# EAGLE design stm32-shield (EAGLE 9.6.2)
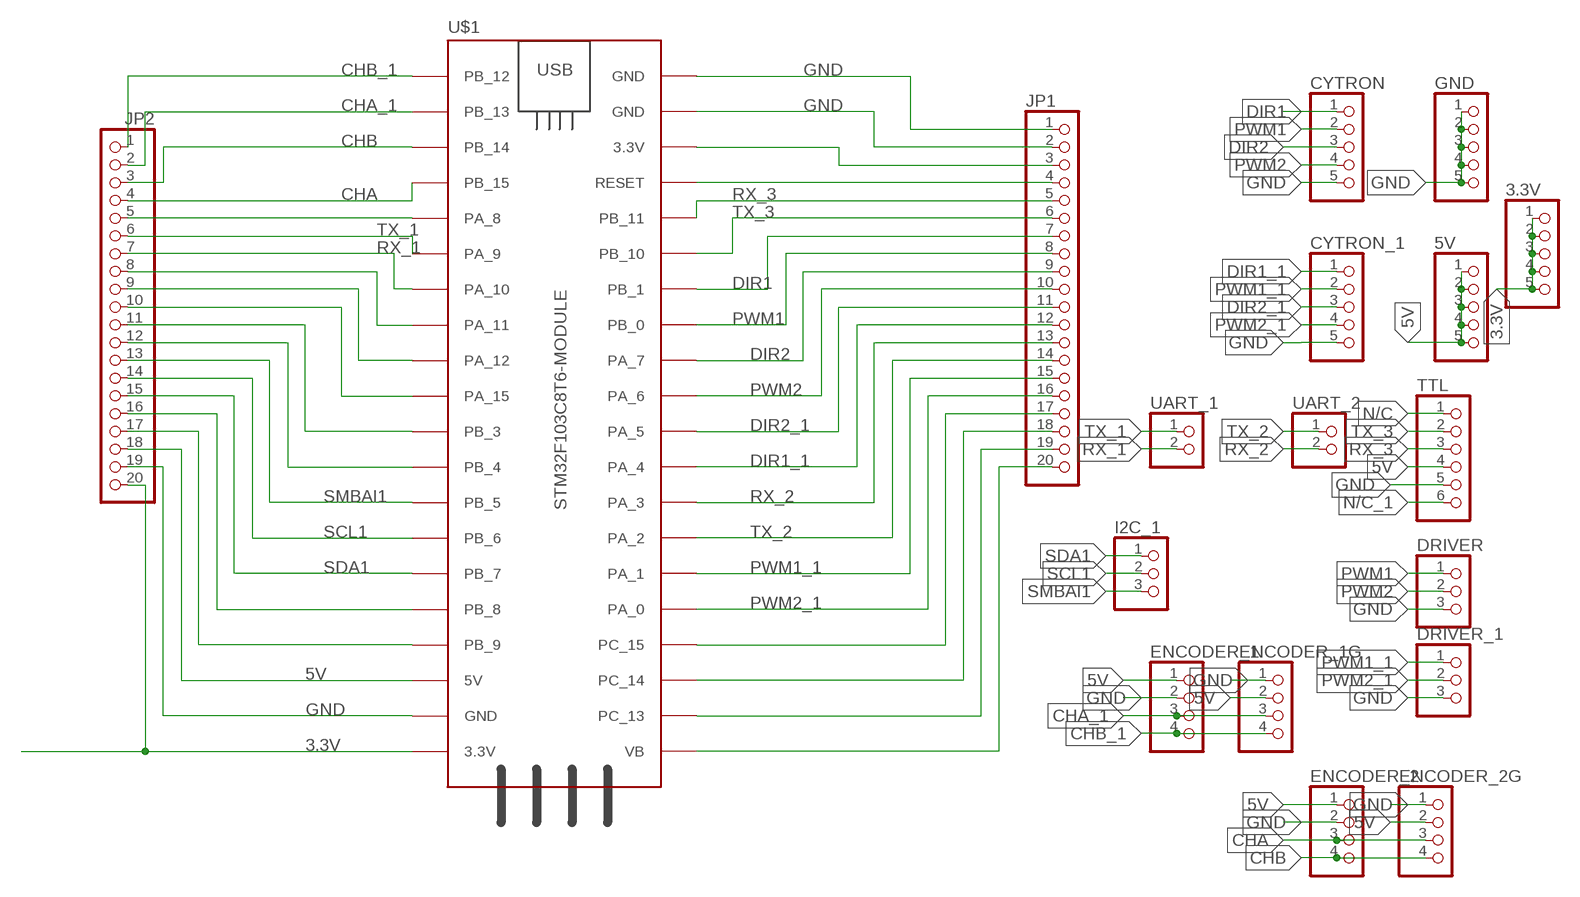
[diagram p0: schematic, sheet 1]

## Parts
3.3V  PINHD-1X5  [1X05]
5V  PINHD-1X5  [1X05]
CYTRON  PINHD-1X5  [1X05]
CYTRON_1  PINHD-1X5  [1X05]
DRIVER  PINHD-1X3  [1X03]
DRIVER_1  PINHD-1X3  [1X03]
ENCODER_1  PINHD-1X4  [1X04]
ENCODER_1G  PINHD-1X4  [1X04]
ENCODER_2  PINHD-1X4  [1X04]
ENCODER_2G  PINHD-1X4  [1X04]
GND  PINHD-1X5  [1X05]
I2C_1  PINHD-1X3  [1X03]
JP1  PINHD-1X20  [1X20]
JP2  PINHD-1X20  [1X20]
TTL  PINHD-1X6  [1X06]
U$1  STM32F103C8T6-MODULE  [STM32F103C8T6-MODULE]
UART_1  PINHD-1X2  [1X02]
UART_2  PINHD-1X2  [1X02]

## Nets
3.3V: 3.3V.1 3.3V.2 3.3V.3 3.3V.4 3.3V.5 JP2.20 U$1.3.3V_1(3.3V)
5V: 5V.1 5V.2 5V.3 5V.4 5V.5 ENCODER_1.1 ENCODER_1G.2 ENCODER_2.1 ENCODER_2G.2 JP2.18 TTL.4 U$1.5V
8183: JP2.17 U$1.PB_9
823828: JP2.16 U$1.PB_8
CHA: ENCODER_2.3 ENCODER_2G.3 JP2.4 U$1.PB_15
CHA_1: ENCODER_1.3 ENCODER_1G.3 JP2.2 U$1.PB_13
CHB: ENCODER_2.4 ENCODER_2G.4 JP2.3 U$1.PB_14
CHB_1: ENCODER_1.4 ENCODER_1G.4 JP2.1 U$1.PB_12
DIR1: CYTRON.1 JP1.7 U$1.PB_1
DIR1_1: CYTRON_1.1 JP1.12 U$1.PA_4
DIR2: CYTRON.3 JP1.9 U$1.PA_7
DIR2_1: CYTRON_1.3 JP1.11 U$1.PA_5
GND: CYTRON.5 CYTRON_1.5 DRIVER.3 DRIVER_1.3 ENCODER_1.2 ENCODER_1G.1 ENCODER_2.2 ENCODER_2G.1 GND.1 GND.2 GND.3 GND.4 GND.5 JP1.1 JP1.2 JP2.19 TTL.5 U$1.GND_1(GND) U$1.GND_2(GND) U$1.GND_3(GND)
N$3: JP1.3 U$1.3.3V_2(3.3V)
N$4: JP1.4 U$1.RESET
N$17: JP1.17 U$1.PC_15
N$18: JP1.18 U$1.PC_14
N$19: JP1.19 U$1.PC_13
N$20: JP1.20 U$1.VB
N$25: JP2.5 U$1.PA_8
N$28: JP2.8 U$1.PA_11
N$29: JP2.9 U$1.PA_12
N$30: JP2.10 U$1.PA_15
N$31: JP2.11 U$1.PB_3
N$32: JP2.12 U$1.PB_4
N/C: TTL.1
N/C_1: TTL.6
PWM1: CYTRON.2 DRIVER.1 JP1.8 U$1.PB_0
PWM1_1: CYTRON_1.2 DRIVER_1.1 JP1.15 U$1.PA_1
PWM2: CYTRON.4 DRIVER.2 JP1.10 U$1.PA_6
PWM2_1: CYTRON_1.4 DRIVER_1.2 JP1.16 U$1.PA_0
RX_1: JP2.7 U$1.PA_10 UART_1.2
RX_2: JP1.13 U$1.PA_3 UART_2.2
RX_3: JP1.5 TTL.3 U$1.PB_11
SCL1: I2C_1.2 JP2.14 U$1.PB_6
SDA1: I2C_1.1 JP2.15 U$1.PB_7
SMBAI1: I2C_1.3 JP2.13 U$1.PB_5
TX_1: JP2.6 U$1.PA_9 UART_1.1
TX_2: JP1.14 U$1.PA_2 UART_2.1
TX_3: JP1.6 TTL.2 U$1.PB_10

## Library data of the parts
3.3V 5V CYTRON CYTRON_1 GND = pinhead:PINHD-1X5: PIN HEADER
DRIVER DRIVER_1 I2C_1 = pinhead:PINHD-1X3: PIN HEADER
ENCODER_1 ENCODER_1G ENCODER_2 ENCODER_2G = pinhead:PINHD-1X4: PIN HEADER
JP1 JP2 = pinhead:PINHD-1X20: PIN HEADER
TTL = pinhead:PINHD-1X6: PIN HEADER
U$1 = stm32f103c8t6_module:STM32F103C8T6-MODULE: STM32F103C8T6 module with ARM Cortex-3, 20kB SRAM, 64kB Flash, 72MHz
UART_1 UART_2 = pinhead:PINHD-1X2: PIN HEADER

## Board
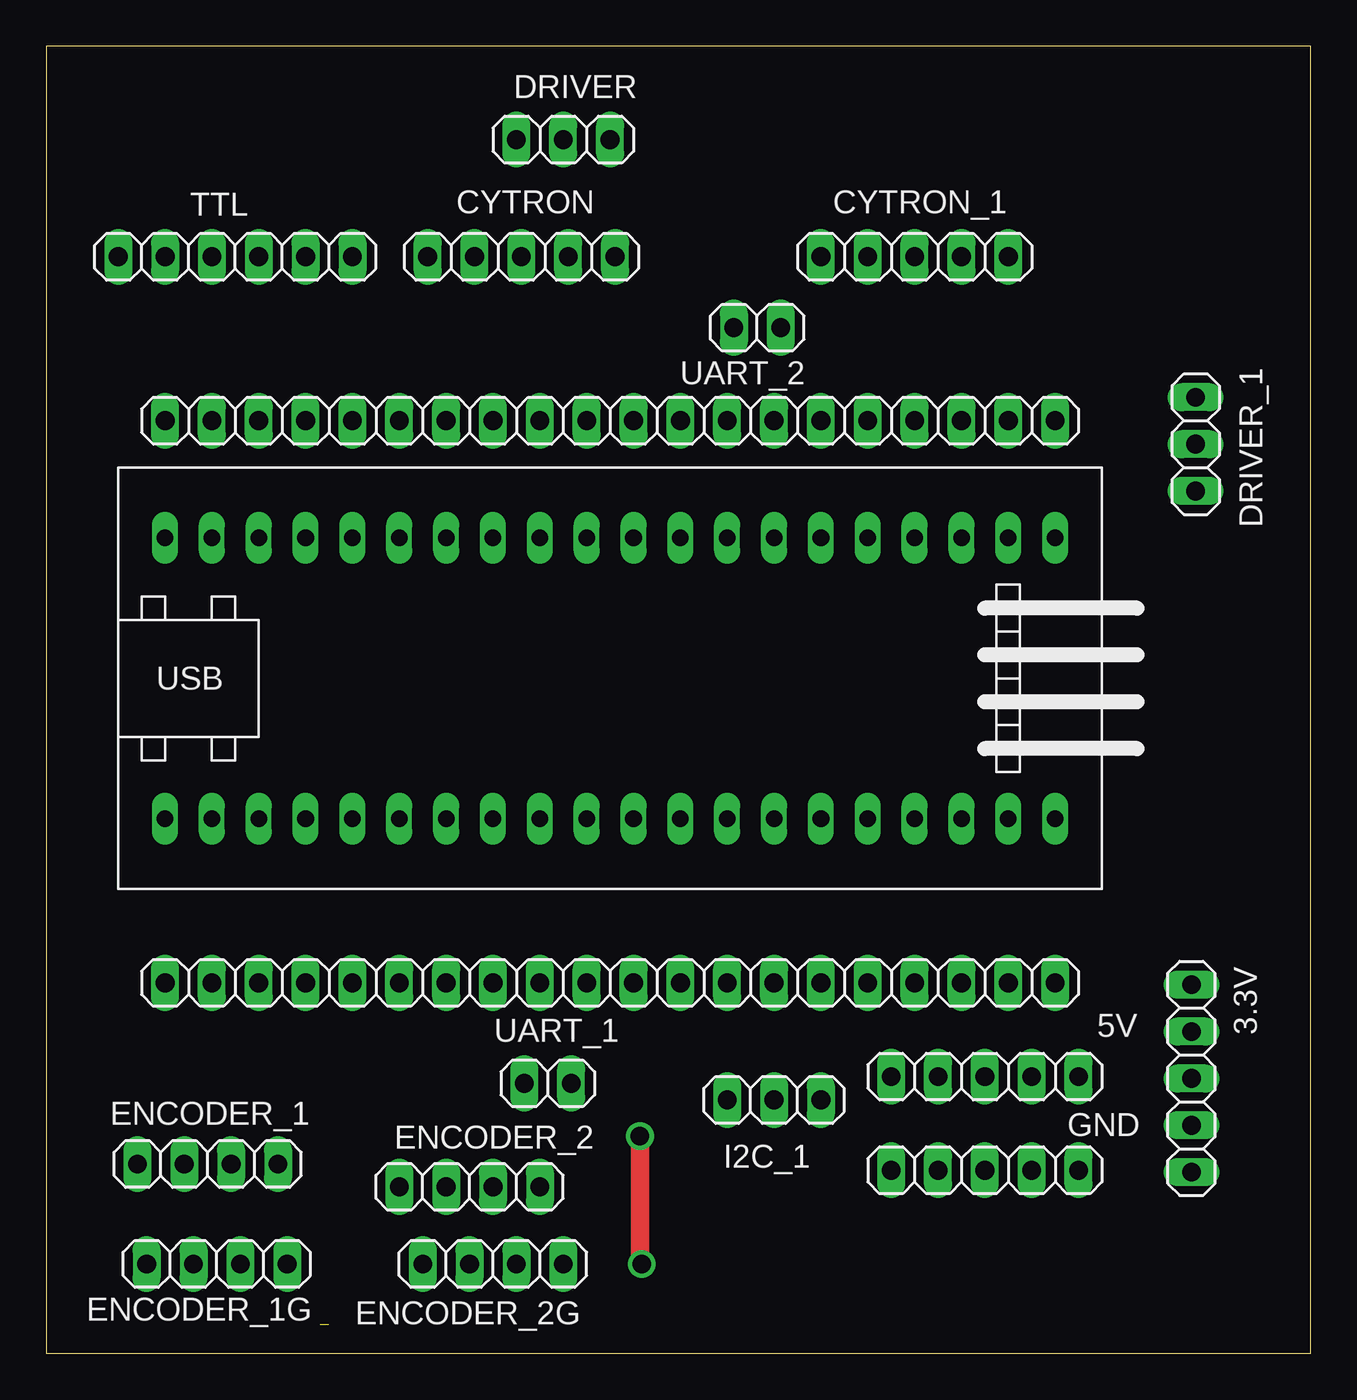
[diagram p1: board, top side]
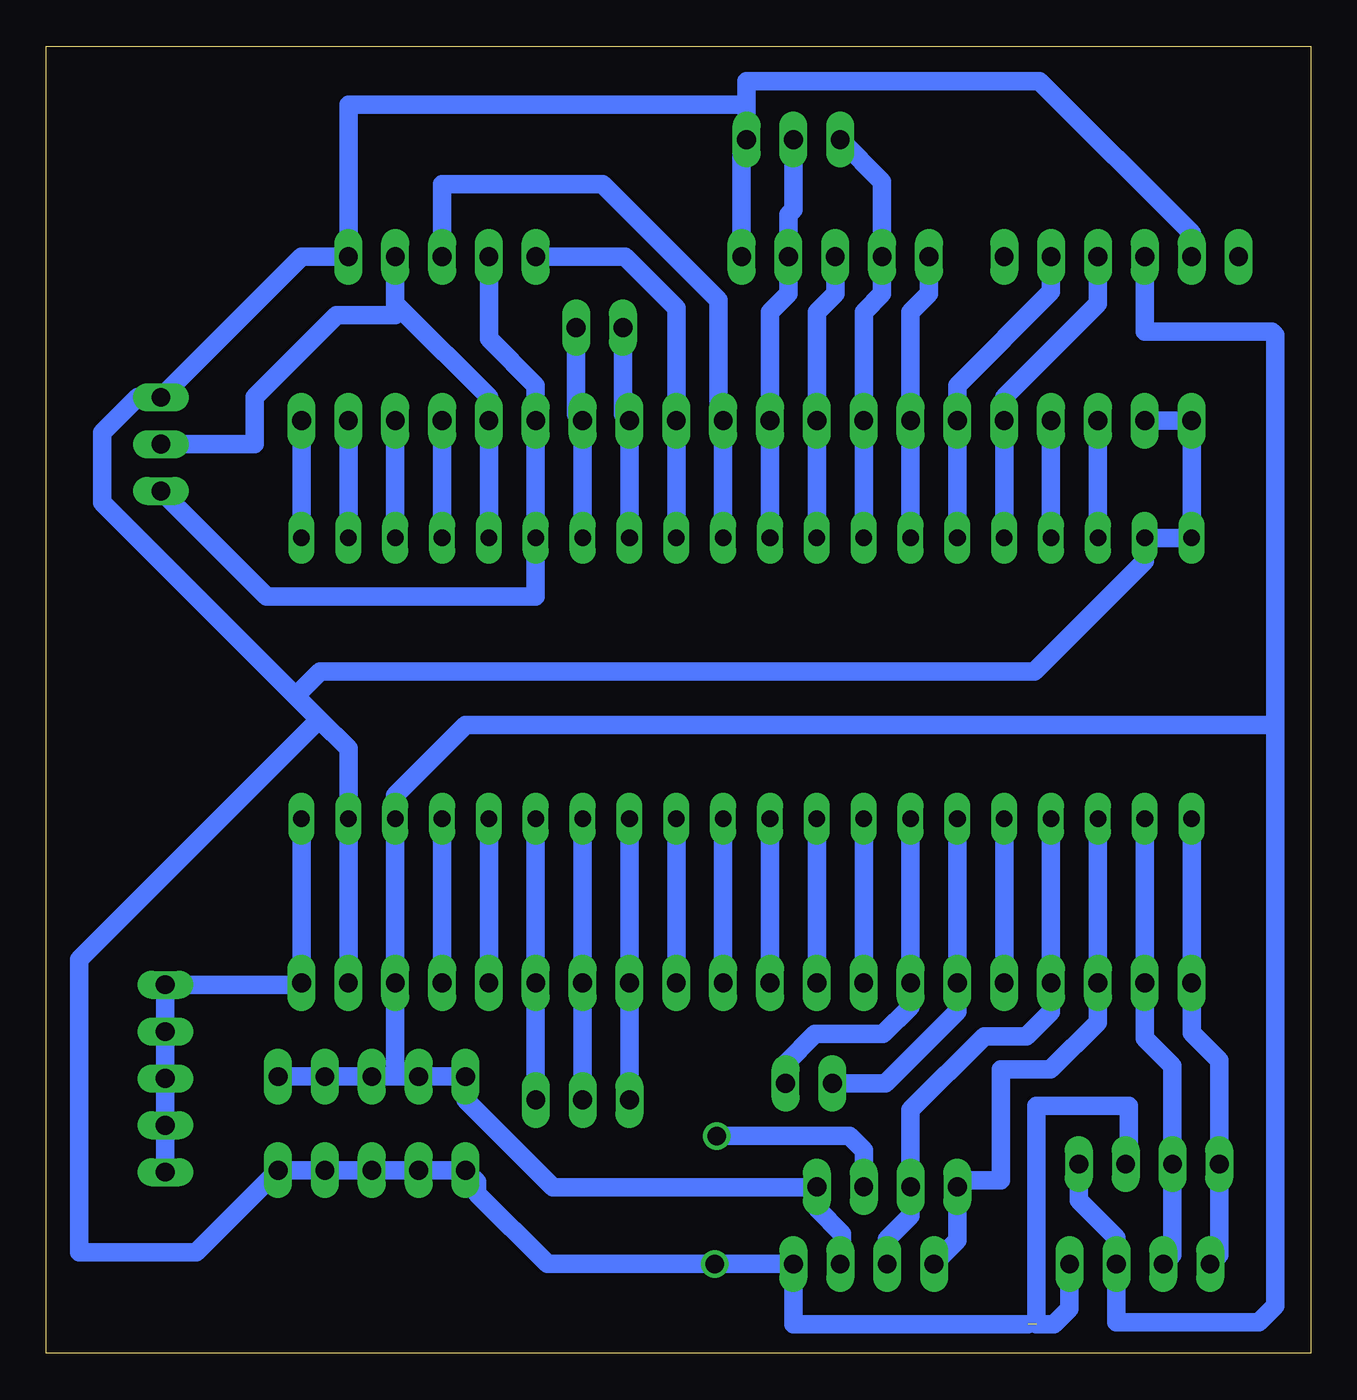
[diagram p2: board, bottom side, seen from below]

Size 68.56 x 70.88 mm. Coordinates in mm from the lower left corner, seen from the top.
Outline: 0,0 68.56,0 68.56,70.88 0,70.88 0,0
Copper layers (1*16): Top 0.035mm / dielectric 1.5mm / Bottom 0.035mm
Design rules "default *": minimum track width 1mm, minimum drill 1mm, track to track 0.8mm, track to pad 0.8mm, pad to pad 6mil, via to via 6mil, smd to smd 6mil, copper to edge 0.8mm, drill to drill 0.8mm, minimum pad ring 10mil, minimum via ring 8mil, stop-mask expansion 4mil, vias tented up to drill 0mil, thermal gap 10mil

### Footprints (pad centres in the part's own frame; a part is rotated, then mirrored left to right if it is on the bottom)
1X05 = drill 1.016 long: 1 -5.08,0; 2 -2.54,0; 3 0,0; 4 2.54,0; 5 5.08,0
1X03 = drill 1.016 long: 1 -2.54,0; 2 0,0; 3 2.54,0
1X04 = drill 1.016 long: 1 -3.81,0; 2 -1.27,0; 3 1.27,0; 4 3.81,0
1X20 = drill 1.016 long: 1 -24.13,0; 2 -21.59,0; 3 -19.05,0; 4 -16.51,0; 5 -13.97,0; 6 -11.43,0; 7 -8.89,0; 8 -6.35,0; 9 -3.81,0; 10 -1.27,0; 11 1.27,0; 12 3.81,0; 13 6.35,0; 14 8.89,0; 15 11.43,0; 16 13.97,0; 17 16.51,0; 18 19.05,0; 19 21.59,0; 20 24.13,0
1X06 = drill 1.016 long: 1 -6.35,0; 2 -3.81,0; 3 -1.27,0; 4 1.27,0; 5 3.81,0; 6 6.35,0
STM32F103C8T6-MODULE = drill 0.9 long: 3.3V_1 25.4,-7.62; 3.3V_2 -17.78,7.62; 5V 20.32,-7.62; GND_1 22.86,-7.62; GND_2 -20.32,7.62; GND_3 -22.86,7.62; PA_0 15.24,7.62; PA_1 12.7,7.62; PA_2 10.16,7.62; PA_3 7.62,7.62; PA_4 5.08,7.62; PA_5 2.54,7.62; PA_6 0,7.62; PA_7 -2.54,7.62; PA_8 -12.7,-7.62; PA_9 -10.16,-7.62; PA_10 -7.62,-7.62; PA_11 -5.08,-7.62; PA_12 -2.54,-7.62; PA_15 0,-7.62; PB_0 -5.08,7.62; PB_1 -7.62,7.62; PB_3 2.54,-7.62; PB_4 5.08,-7.62; PB_5 7.62,-7.62; PB_6 10.16,-7.62; PB_7 12.7,-7.62; PB_8 15.24,-7.62; PB_9 17.78,-7.62; PB_10 -10.16,7.62; PB_11 -12.7,7.62; PB_12 -22.86,-7.62; PB_13 -20.32,-7.62; PB_14 -17.78,-7.62; PB_15 -15.24,-7.62; PC_13 22.86,7.62; PC_14 20.32,7.62; PC_15 17.78,7.62; RESET -15.24,7.62; VB 25.4,7.62
1X02 = drill 1.016 long: 1 -1.27,0; 2 1.27,0

### Placement (x,y rotation side)
3.3V  62.1,14.91 90 top
5V  50.9,15.01 0 top
CYTRON  25.77,59.46 0 top
CYTRON_1  47.09,59.46 0 top
DRIVER  28.04,65.81 0 top
DRIVER_1  62.33,49.3 90 top
ENCODER_1  8.76,10.27 180 top
ENCODER_1G  9.26,4.85 180 top
ENCODER_2  22.96,9.03 180 top
ENCODER_2G  24.23,4.85 180 top
GND  50.9,9.93 0 top
I2C_1  39.47,13.74 180 top
JP1  30.58,50.57 0 top
JP2  30.58,20.09 0 top
TTL  10.26,59.46 180 top
U$1  29.31,36.6 0 top
UART_1  27.2,14.64 0 top
UART_2  38.55,55.62 180 top

### Tracks (layer width: path | path; a pad name or v marks a point on that pad's centre or on a via)
3.3V
  Bottom 1: U$1.3.3V_1 JP2.20 54.81,19.99 3.3V.5 3.3V.4 3.3V.3 3.3V.2 3.3V.1
5V
  Bottom 1: ENCODER_2G.2 25.4,4.95 25.4,6.49 26.77,7.86 ENCODER_2.1 26.8,9 41.08,9 45.82,13.74 5V.1 5V.2 49.63,15.01 | 49.63,15.01 5V.3 5V.4 5V.5 | 49.63,15.01 JP2.18 U$1.5V 49.63,30.25 45.82,34.06 1.91,34.06 | ENCODER_1.1 12.57,8.3 10.53,6.26 ENCODER_1G.2 10.53,1.67 2.81,1.67 1.91,2.58 1.91,34.06 | TTL.4 8.99,55.39 2.1,55.39 1.91,55.2 1.91,34.06
8183
  Bottom 1: JP2.17 U$1.PB_9
823828
  Bottom 1: JP2.16 U$1.PB_8
CHA
  Bottom 1: ENCODER_2G.3 22.96,6.19 21.69,7.46 ENCODER_2.3 21.69,13.2 17.7,17.19 15.4,17.19 14.07,18.52 JP2.4 U$1.PB_15
CHA_1
  Bottom 1: ENCODER_1G.3 7.49,5.35 ENCODER_1.3 7.49,15.59 8.99,17.09 JP2.2 U$1.PB_13
CHB
  Bottom 1: ENCODER_2G.4 19.15,6.12 ENCODER_2.4 18.79,9.39 16.8,9.39 16.8,15.39 14.1,15.39 11.53,17.96 JP2.3 U$1.PB_14
CHB_1
  Bottom 1: ENCODER_1G.4 4.95,5.35 ENCODER_1.4 4.95,15.89 6.45,17.39 JP2.1 U$1.PB_12
DIR1
  Bottom 1: U$1.PB_1 JP1.7 21.69,56.46 20.69,57.46 CYTRON.1
DIR1_1
  Bottom 1: U$1.PA_4 JP1.12 34.39,56.68 37.17,59.46 CYTRON_1.1
DIR2
  Bottom 1: U$1.PA_7 JP1.9 26.77,56.46 25.77,57.46 CYTRON.3
DIR2_1
  Bottom 1: U$1.PA_5 JP1.11 32.1,50.82 32.1,57.1 38.39,63.39 47.1,63.39 CYTRON_1.3
GND  (via drill 1)  (1 unrouted)
  Top 1: v32.2,11.79 32.2,4.95 v32.3,4.85
  Bottom 1: 15.33,1.58 28.04,1.58 ENCODER_2G.1 v32.3,4.85 41.38,4.85 45.19,8.66 45.19,9.29 GND.1 GND.2 GND.3 GND.4 GND.5 60.43,5.48 66.77,5.48 66.77,21.36 53.76,34.38 | TTL.5 6.45,60.73 14.71,68.98 30.58,68.98 30.58,67.72 | 30.58,67.72 DRIVER.3 30.85,65.54 CYTRON.5 | JP1.2 JP1.1 U$1.GND_3 U$1.GND_2 8.99,42.95 14.97,36.96 53.71,36.96 55.03,35.65 | JP2.19 U$1.GND_1 52.17,32.79 53.76,34.38 | 55.03,35.65 65.5,46.12 65.5,49.94 63.6,51.84 DRIVER_1.3 54.71,59.46 CYTRON_1.5 52.17,67.72 30.58,67.72 | 55.03,35.65 53.76,34.38 | ENCODER_1G.1 13.07,2.42 13.91,1.58 14.87,1.58 14.87,13.43 9.87,13.43 9.87,10.43 ENCODER_1.2 | ENCODER_2.2 24.23,11.02 25,11.79 v32.2,11.79
N$3
  Bottom 1: JP1.3 U$1.3.3V_2
N$4
  Bottom 1: JP1.4 U$1.RESET
N$17
  Bottom 1: JP1.17 U$1.PC_15
N$18
  Bottom 1: JP1.18 U$1.PC_14
N$19
  Bottom 1: JP1.19 U$1.PC_13
N$20
  Bottom 1: JP1.20 U$1.VB
N$25
  Bottom 1: JP2.5 U$1.PA_8
N$28
  Bottom 1: JP2.8 U$1.PA_11
N$29
  Bottom 1: JP2.9 U$1.PA_12
N$30
  Bottom 1: JP2.10 U$1.PA_15
N$31
  Bottom 1: JP2.11 U$1.PB_3
N$32
  Bottom 1: JP2.12 U$1.PB_4
PWM1
  Bottom 1: U$1.PB_0 JP1.8 24.23,56.46 23.23,57.46 CYTRON.2 23.23,63.54 DRIVER.1
PWM1_1
  Bottom 1: CYTRON_1.2 44.55,55.02 42.01,52.48 JP1.15 U$1.PA_1 42.01,41.05 56.62,41.05 DRIVER_1.1
PWM2
  Bottom 1: U$1.PA_6 JP1.10 29.31,56.46 28.31,57.46 CYTRON.4 28.31,61.73 28.04,62 DRIVER.2
PWM2_1
  Bottom 1: U$1.PA_0 JP1.16 44.55,51.84 49.31,56.6 | CYTRON_1.4 49.63,56.92 49.31,56.6 | DRIVER_1.2 57.25,49.3 57.25,51.84 52.8,56.29 49.63,56.29 49.31,56.6
RX_1
  Bottom 1: U$1.PA_10 JP2.7 21.69,18.8 23.18,17.32 26.87,17.32 28.47,15.71 UART_1.2
RX_2
  Bottom 1: U$1.PA_3 JP1.13 37.28,50.92 UART_2.2
RX_3
  Bottom 1: U$1.PB_11 JP1.5 16.61,51.84 11.53,56.92 TTL.3
SCL1
  Bottom 1: U$1.PB_6 JP2.14 I2C_1.2
SDA1
  Bottom 1: U$1.PB_7 JP2.15 I2C_1.1
SMBAI1
  Bottom 1: U$1.PB_5 JP2.13 I2C_1.3
TX_1
  Bottom 1: U$1.PA_9 JP2.6 19.15,18.54 23.05,14.64 UART_1.1
TX_2
  Bottom 1: U$1.PA_2 JP1.14 39.82,50.92 UART_2.1
TX_3
  Bottom 1: U$1.PB_10 JP1.6 19.15,52.48 14.07,57.55 TTL.2